# Altium project Control Board.PrjPcb
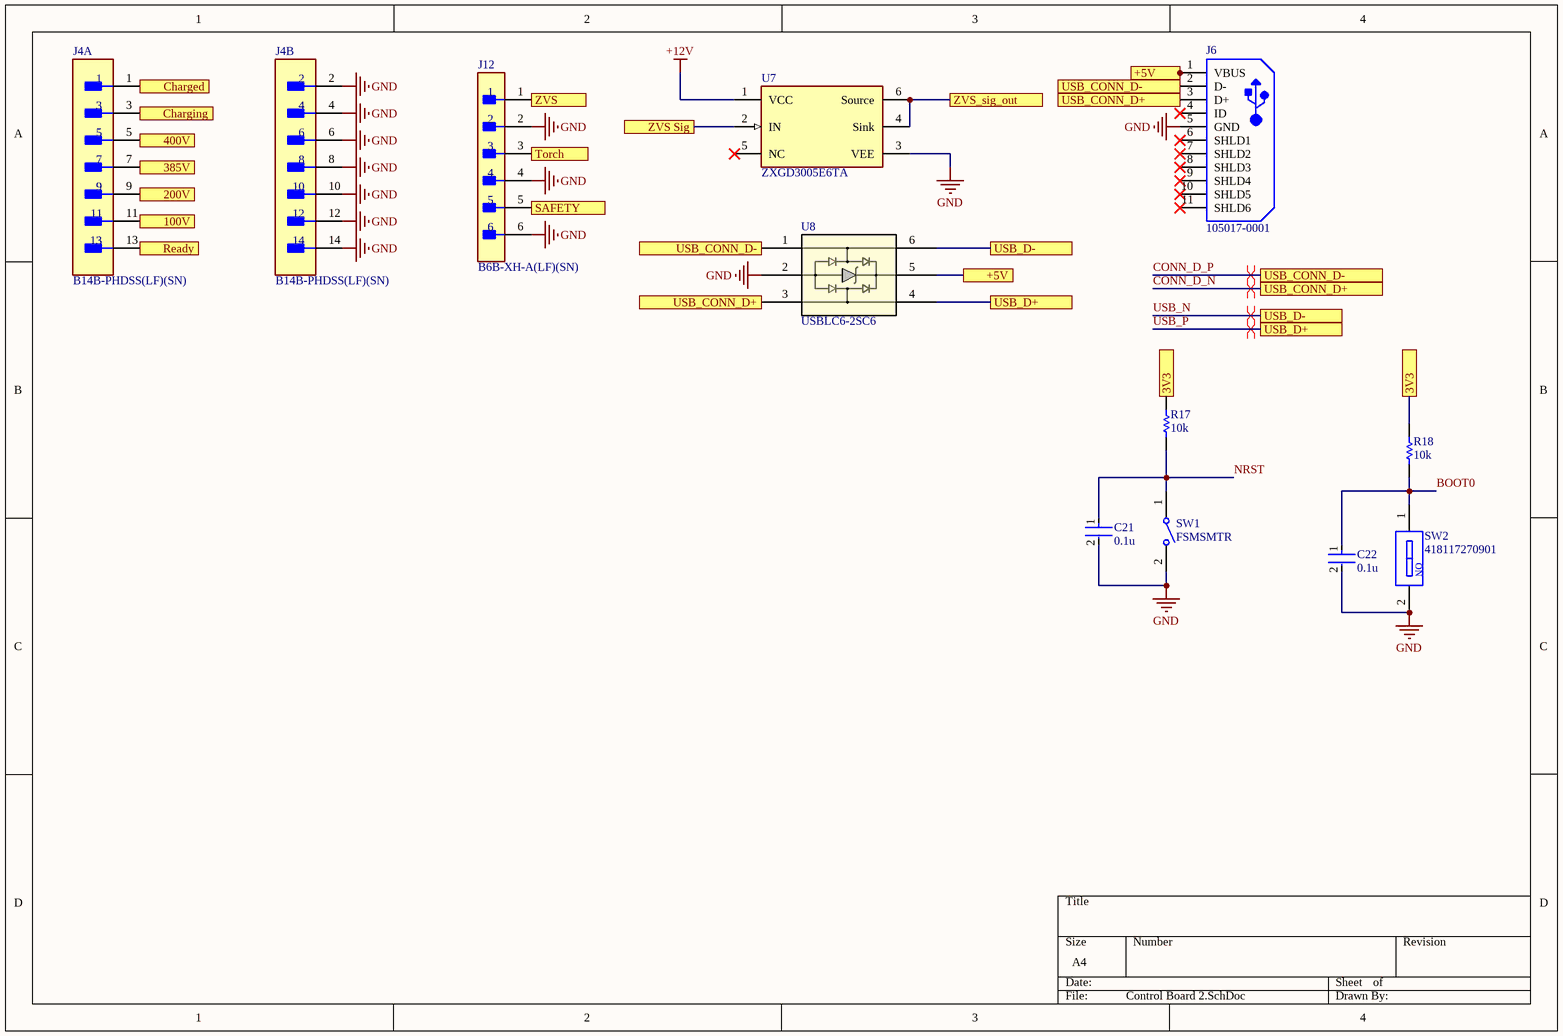
[diagram p0: Control Board 2.SchDoc]
2 sheets, 75 parts. Net scope: global (net labels, ports and power ports of the same name join across sheets).
Board file: Control board.PcbDoc
Sheets:
  Control Board 2.SchDoc
  Control board.SchDoc

## Sheet Control Board 2.SchDoc
size A4; SheetNumber: 1; SheetTotal: 2

### Parts
C21  0.1u  [FP-GRM188-0_1-e0_2_0_55-IPC_A]
C22  0.1u  [FP-GRM188-0_1-e0_2_0_55-IPC_A]
J4  B14B-PHDSS(LF)(SN)  [FP-B14B-PHDSS_LF_SN-MFG]  (parts A,B of 2)
J6  105017-0001  [USB-MICRO-B_V]
J12  B6B-XH-A(LF)(SN)  [FP-B6B-XH-A_LF_SN-MFG]
R17  10k  [RESC1609X50X30NL8T20]
R18  10k  [RESC1609X50X30NL8T20]
SW1  FSMSMTR  [TECO-FSMSMTR_V]
SW2  418117270901  [418117270901]
U7  ZXGD3005E6TA  [FP-SOT26_SC74R-MFG]
U8  USBLC6-2SC6  [SOT23-6L_STM]

### Ports
3V3, 100V, 200V, 385V, 400V, +5V, Charged, Charging, Ready, SAFETY, Torch, USB_CONN_D+, USB_CONN_D-, USB_D+, USB_D-, ZVS, ZVS Sig, ZVS_sig_out

### Nets
+12V: U7.1(VCC)
GND: C21.2 C22.2 J4.2 J4.4 J4.6 J4.8 J4.10 J4.12 J4.14 J6.5(GND) J12.2 J12.4 J12.6 SW1.2 SW2.2 U7.3(VEE) U8.2
BOOT0: C22.1 R18.2 SW2.1
CONN_D_N: J6.3(D+) U8.3 ; port USB_CONN_D+
CONN_D_P: J6.2(D-) U8.1 ; port USB_CONN_D-
NRST: C21.1 R17.2 SW1.1
USB_N: U8.6 ; port USB_D-
USB_P: U8.4 ; port USB_D+
NetC1_1: J6.1(VBUS) U8.5 ; port +5V
NetC2_1: R17.1 R18.1 ; port 3V3
NetJ3_1: U7.4(Sink) U7.6(Source) ; port ZVS_sig_out
NetJ4_1: J4.1 ; port Charged
NetJ4_3: J4.3 ; port Charging
NetJ4_5: J4.5 ; port 400V
NetJ4_7: J4.7 ; port 385V
NetJ4_9: J4.9 ; port 200V
NetJ4_11: J4.11 ; port 100V
NetJ4_13: J4.13 ; port Ready
NetJ12_1: J12.1 ; port ZVS
NetJ12_3: J12.3 ; port Torch
NetJ12_5: J12.5 ; port SAFETY
NetU1_51: U7.2(IN) ; port ZVS Sig

Not connected (* = marked no-connect by the designer): J6 4(ID)* 6(SHLD1)* 7(SHLD2)* 8(SHLD3)* 9(SHLD4)* 10(SHLD5)* 11(SHLD6)*; U7 5(NC)*

### Layout directives
differential pair: CONN_D_N, CONN_D_P, USB_N, USB_P

### Notes on the sheet
- (in symbol CMP-1435-00001-2) ON

### Library data of the parts
C21 C22 = CMP-2006-02792-2: Chip Multilayer Ceramic Capacitors for General Purpose, 0603, 10uF, X5R, 15%, 20%, 6.3V; Packaging: Tape and Reel; Voltage Rating (DC): 6.3V; Width: 0.031inch; Termination: SMD/SMT; Dielectric: X5R; Package Quantity: 4000; Voltage Rating: 6.3V; Capacitance: 10uF; Case/Package: 0603; Min Operating Temperature: -55°C; Voltage: 6.3V; Length: 1.6mm; Thickness: 0.035inch; Lead Free: Lead Free; Depth: 0.8mm; Case Code (Imperial): 0603; Max Operating Temperature: 85°C; Material: Ceramic; Height: 0.8mm; Tolerance: 20%; Mount: Surface Mount; REACH SVHC: No SVHC; Radiation Hardening: No; Case Code (Metric): 1608
J4 = CMP-17439-000218-1: CONN HEADER VERT 14POS 2MM; Current Rating: 3A; Gender: Male; Mated Stacking Heights: 8.8mm; Voltage Rating: 250V; Number of Positions: 14; Row Spacing: 0.079inch; Number of Rows: 2; Contact Material: Copper Alloy; Series: PHD; Contact Type: Male Pin; Termination: Solder; Packaging: Bulk; Fastening Type: Detent; Length: 15.9mm; Mount: Through Hole; Insulation Material: Nylon; Contact Plating: Tin; Lead Free: Lead Free; Height: 9.5mm; Housing Material: Nylon; Width: 5mm; Color: Natural; Contact Shape: Square; Flammability Rating: UL94 V-0; Pitch: 2mm; Contact Finish - Mating: TIN; Contact Mating Length: 0.114inch; Insulation Color: Natural; Connector Type: Header; Housing Color: Natural; Number of Contacts: 14
J6 = CMP-2000-05827-1: Micro-USB B Receptacle, Right Angle, Bottom Mount, Surface Mount, with Solder Tabs, -30 to 85 degC, 5-Pin USB, RoHS, Tape and Reel; Manufacturer: Molex; Featured Product: Micro-USBConnectorsUSBConnectors; Other Names: WM1399DKR; Package Version: Rev. F, 12/2012; Number of Contacts: 5; Connector Type: USB-microB; Catalog Drawings: 1050170001; 3D Model: 105017-0001.stp; Mating Products: WM17145-ND-CABLEMICROUSBBTOSTDA1.0MWM17147-ND-CABLEMICROUSBBTOSTDA2.0MWM17146-ND-CABLEMICROUSBBTOSTDA1.5M; PCN Assembly/Origin: ResinSupplier21/Oct/2015; Voltage - Max: 30V; Online Catalog: Molex-MicroUSB; Manufacturer URL: http://www.molex.com/; Package Description: 5-Leads USB, Micro B, Body 7.5 x 5 mm, Pitch 0.65 mm; Datasheet URL: http://www.molex.com/elqNow/elqRedir.htm?ref=http://www.molex.com/webdocs/datasheets/pdf/en-us/1050170001_IO_CONNECTORS.pdf; Ingress Protection: -; Datasheet Version: 03/2016; Mounting Type: BoardCutout,SurfaceMount,RightAngle; Circuits: 5; Standard Package: 1; Package Reference: MICRO-B; Package URL: http://www.molex.com/pdm_docs/sd/1050170001_sd.pdf; Category: Connectors,Interconnects; Series: -; RoHS Information: 1050170001CertofCompliance; Features: Shielded,SolderRetention; Family: USB,DVI,HDMIConnectors; Specifications: -; Gender: Receptacle; Packaging: Digi-Reel®; Mounting Technology: SurfaceMount
J12 = CMP-17439-000076-1: CONN HEADER VERT 6POS 2.5MM
R17 R18 = CMP-1666-00005-4: Chip Resistor, 10 KOhm, +/- 1%, 100 mW, -55 to 155 degC, 0603 (1608 Metric), RoHS, Tape and Reel; Manufacturer: Vishay Semiconductor; Voltage Rating: 75 V; Max Operating Temperature: 155 degC; PackageDescription: 2-Pin Surface Mount Device, Body 1.575 x 0.85 mm; ComponentLink1Description: Manufacturer URL; RoHSCompliant: true; PackageReference: 0603; REACH SVHC: Unknown; Length: 1.55 mm; DatasheetVersion: 06/2012; Packaging: Tape and Reel; Min Operating Temperature: -55 degC; Mounting Technology: Surface Mount; ComponentLink2URL: https://datasheet.ciiva.com/11809/0900766b80d98afc-11809037.pdf; Height: 0.45 mm; ComponentLink2Description: Datasheet; Package Quantity: 5000; ComponentLink1URL: http://www.vishay.com/
SW1 = CMP-2000-07501-1: FSMSM Push Button Switch, 50 mA, -35 to 85 degC, 2-Pin SMD, RoHS, Tape and Reel; Manufacturer: TE Connectivity; Voltage Rating (DC): 24V; Electrical Life: 20000Cycles; Operating Force: 180gf; Switch Travel: 0.25mm; Contact Current Rating: 50mA; Case\/Package: SMD/SMT; Actuator Length: 1.07mm; Throw Configuration: SPST; Actuator Material: Polyamide; Contact Resistance: 100mOhm; Illumination Type: Illuminated; Max Voltage Rating (DC): 12V; Manufacturer URL: http://www.te.com/; Lead Free: LeadFree; Packaging: TapeandReel; Min Operating Temperature: -35degC; Mechanical Life: 20000Cycles; Mount: SurfaceMount; REACH SVHC: Unknown; Package Quantity: 1800; Package Reference: FSMSMTR; RoHSCompliant: true; Max Operating Temperature: 85degC; Orientation: Straight; ELV: Compliant; Datasheet URL: http://www.te.com/commerce/DocumentDelivery/DDEController?Action=showdoc&DocId=Customer+Drawing%7F1437566-3%7FC2%7Fpdf%7FEnglish%7FENG_CD_1437566-3_C2_1437566_3_1_c.dwg.pdf%7F1437566-4; Package Description: 2-Pin Surface Mount Device, Body 6 x 3.5 mm, Pitch 9.19 mm; Current Rating: 50mA; Contact Plating: Silver; Termination: GullWing; Datasheet Version: Rev. C2, 08/2014; Contact Material: Brass; Mounting Technology: SurfaceMount
SW2 = CMP-1435-00001-2: NexarPartId: 22584988; Mechanical Life: 5kcycles; Number of Positions: 1; Life (Cycles): 2kcycles; Insulation Resistance: 100MΩ; Contact Resistance: 50mΩ; Voltage Rating: 24V; Current Rating: 25mA; Body Material: Nylon, Polyamide; Washable: No; Throw Configuration: SPST; Pitch: 2.54mm; Lead Free: Lead Free; Mount: Through Hole; Max Operating Temperature: 85°C; RoHS: Compliant; Number of Pins: 1; Height: 6.95mm; Min Operating Temperature: -40°C; Termination: PC Pin; Number of Circuits: 1; Contact Current Rating: 25mA; Contact Plating: Gold; Electrical Life: 2kcycles; Voltage Rating (DC): 24V; Length: 3.84mm
U7 = CMP-12751-000002-1: IC GATE DRVR LOW-SIDE SOT26; Manufacturer: DIODES INC.; Max Supply Voltage: 25V; Number Of Outputs: 1; Max Power Dissipation: 1.1W; Fall Time: 16ns; Automotive Grade: Grade 0; Output Current: 10A; Rise Time: 8ns; Max Junction Temp: +150°C; Nominal Supply Current: 0.05uA; Standoff Height: 0.013mm; RoHS: TRUE; Temperature Range Low: -55°C; Octopart: https://octopart.com/zxgd3005e6ta-diodes+inc.-19727179; Lead Free: Yes; Device Class L3: Gate Drivers; ComponentLink2URL: https://www.diodes.com/assets/Datasheets/ZXGD3005E6.pdf; Digikey Description: IC GATE DRVR LOW-SIDE SOT26; ComponentLink2Description: Datasheet; Category: IC; Footprint Url: https://www.diodes.com/assets/Package-Files/SOT26-SC74R.pdf; Device Class L1: Integrated Circuits (ICs); Automotive: Yes; Device Class L2: Power Management ICs; Mouser Description: Gate Drivers 10A GATE DRIVER 25V VCC 25V VIN; Manufacturer Part Number: ZXGD3005E6TA; Ipc Land Pattern Name: SOT95P280X115-6; Height: 1.4mm; Temperature Range High: +150°C; Package: SOT26 (SC74R); Number Of Drivers: 1; Temperature: -55°C to +150°C
U8 = USBLC6-2SC6: No Description Available; Mfr_Name: STMicroelectronics; Copyright: Copyright (C) 2023 Ultra Librarian. All rights reserved.; Manufacturer_Part_Number: USBLC6-2SC6; RefDes: RefDes; Type: DEV

## Sheet Control board.SchDoc
size A4; SheetNumber: 2; SheetTotal: 2
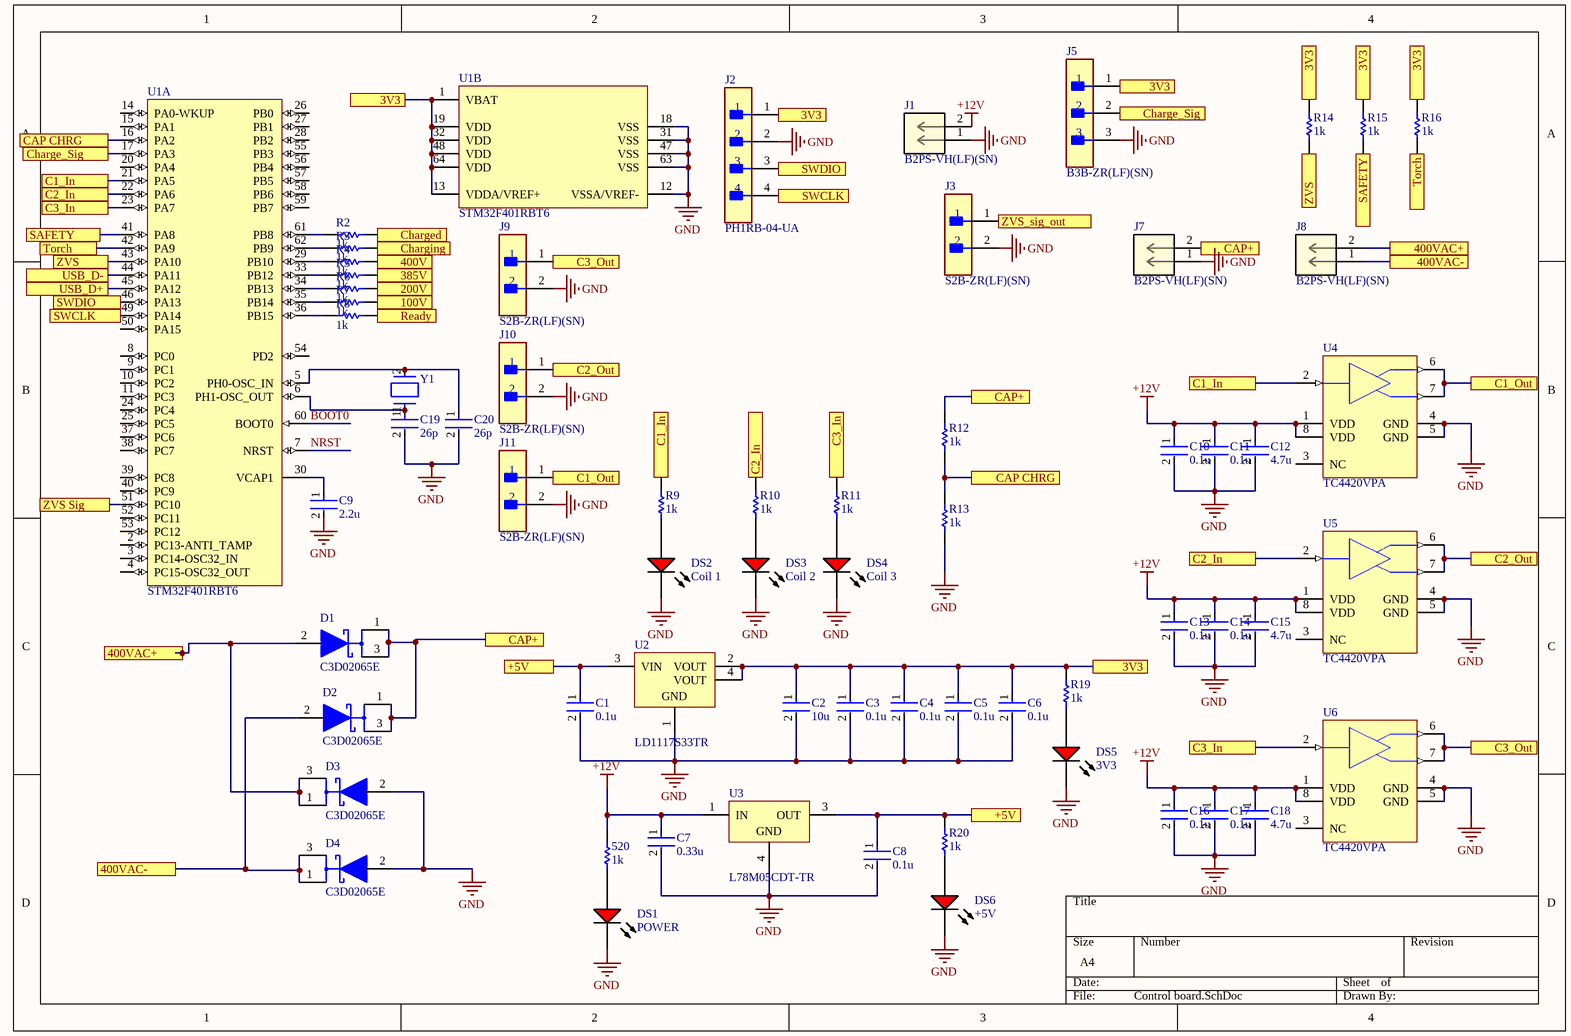
[diagram p1: Control board.SchDoc]

### Parts
520  1k  [RESC1609X50X30NL8T20]
C1  0.1u  [FP-GRM188-0_1-e0_2_0_55-IPC_A]
C2  10u  [FP-GRM188-0_1-e0_2_0_55-IPC_A]
C3  0.1u  [FP-GRM188-0_1-e0_2_0_55-IPC_A]
C4  0.1u  [FP-GRM188-0_1-e0_2_0_55-IPC_A]
C5  0.1u  [FP-GRM188-0_1-e0_2_0_55-IPC_A]
C6  0.1u  [FP-GRM188-0_1-e0_2_0_55-IPC_A]
C7  0.33u  [FP-GRM188-0_1-e0_2_0_55-IPC_A]
C8  0.1u  [FP-GRM188-0_1-e0_2_0_55-IPC_A]
C9  2.2u  [FP-GRM188-0_1-e0_2_0_55-IPC_A]
C10  0.1u  [FP-C0603C-CF-MFG]
C11  0.1u  [FP-C0603C-CF-MFG]
C12  4.7u  [FP-C0603C-CF-MFG]
C13  0.1u  [FP-C0603C-CF-MFG]
C14  0.1u  [FP-C0603C-CF-MFG]
C15  4.7u  [FP-C0603C-CF-MFG]
C16  0.1u  [FP-C0603C-CF-MFG]
C17  0.1u  [FP-C0603C-CF-MFG]
C18  4.7u  [FP-C0603C-CF-MFG]
C19  26p  [FP-GRM188-0_1-e0_2_0_55-IPC_A]
C20  26p  [FP-GRM188-0_1-e0_2_0_55-IPC_A]
D1  C3D02065E  [FP-TO-252-2_v2-MFG]
D2  C3D02065E  [FP-TO-252-2_v2-MFG]
D3  C3D02065E  [FP-TO-252-2_v2-MFG]
D4  C3D02065E  [FP-TO-252-2_v2-MFG]
DS1  POWER  [VISH-TLMX1100_V]
DS2  Coil 1  [VISH-TLMX1100_V]
DS3  Coil 2  [VISH-TLMX1100_V]
DS4  Coil 3  [VISH-TLMX1100_V]
DS5  3V3  [VISH-TLMX1100_V]
DS6  +5V  [VISH-TLMX1100_V]
J1  B2PS-VH(LF)(SN)  [CONN_B2PS-VH_JST]
J2  PH1RB-04-UA  [FP-PH1RB-04-UA-MFG]
J3  S2B-ZR(LF)(SN)  [FP-S2B-ZR_LF_SN-MFG]
J5  B3B-ZR(LF)(SN)  [FP-B3B-ZR_LF_SN-MFG]
J7  B2PS-VH(LF)(SN)  [CONN_B2PS-VH_JST]
J8  B2PS-VH(LF)(SN)  [CONN_B2PS-VH_JST]
J9  S2B-ZR(LF)(SN)  [FP-S2B-ZR_LF_SN-MFG]
J10  S2B-ZR(LF)(SN)  [FP-S2B-ZR_LF_SN-MFG]
J11  S2B-ZR(LF)(SN)  [FP-S2B-ZR_LF_SN-MFG]
R2  1k  [RESC1609X50X30NL8T20]
R3  1k  [RESC1609X50X30NL8T20]
R4  1k  [RESC1609X50X30NL8T20]
R5  1k  [RESC1609X50X30NL8T20]
R6  1k  [RESC1609X50X30NL8T20]
R7  1k  [RESC1609X50X30NL8T20]
R8  1k  [RESC1609X50X30NL8T20]
R9  1k  [RESC1609X50X30NL8T20]
R10  1k  [RESC1609X50X30NL8T20]
R11  1k  [RESC1609X50X30NL8T20]
R12  1k  [RESC1609X50X30NL8T20]
R13  1k  [RESC1609X50X30NL8T20]
R14  1k  [RESC1609X50X30NL8T20]
R15  1k  [RESC1609X50X30NL8T20]
R16  1k  [RESC1609X50X30NL8T20]
R19  1k  [RESC1609X50X30NL8T20]
R20  1k  [RESC1609X50X30NL8T20]
U1  STM32F401RBT6  [STM-LQFP64_N]  (parts A,B of 2)
U2  LD1117S33TR  [SOT-223_L]
U3  L78M05CDT-TR  [TO-252_L]
U4  TC4420VPA  [PDIP300-PA8]
U5  TC4420VPA  [PDIP300-PA8]
U6  TC4420VPA  [PDIP300-PA8]
Y1  (no value)  [FP-ABM7-MFG]

### Ports
3V3, 100V, 200V, 385V, 400V, 400VAC+, 400VAC-, +5V, C1_In, C1_Out, C2_In, C2_Out, C3_In, C3_Out, CAP CHRG, CAP+, Charge_Sig, Charged, Charging, Ready, SAFETY, SWCLK, SWDIO, Torch, USB_D+, USB_D-, ZVS, ZVS Sig, ZVS_sig_out

### Nets
+12V: 520.2 C7.1 C10.1 C11.1 C12.1 C13.1 C14.1 C15.1 C16.1 C17.1 C18.1 J1.2 U3.1(IN) U4.1(VDD) U4.8(VDD) U5.1(VDD) U5.8(VDD) U6.1(VDD) U6.8(VDD)
GND: C1.2 C2.2 C3.2 C4.2 C5.2 C6.2 C7.2 C8.2 C9.2 C10.2 C11.2 C12.2 C13.2 C14.2 C15.2 C16.2 C17.2 C18.2 C19.2 C20.2 D3.2(A) D4.2(A) DS1.2(K) DS2.2(K) DS3.2(K) DS4.2(K) DS5.2(K) DS6.2(K) J1.1 J2.2 J3.2 J5.3 J7.1 J9.2 J10.2 J11.2 R13.1 U1.12(VSSA/VREF-) U1.18(VSS) U1.31(VSS) U1.47(VSS) U1.63(VSS) U2.1(GND) U3.4(GND) U4.4(GND) U4.5(GND) U5.4(GND) U5.5(GND) U6.4(GND) U6.5(GND)
BOOT0: U1.60(BOOT0)
NRST: U1.7(NRST)
USB_N: U1.44(PA11) ; port USB_D-
USB_P: U1.45(PA12) ; port USB_D+
Net520_1: 520.1 DS1.1(A)
NetC1_1: C1.1 C8.1 R20.2 U2.3(VIN) U3.3(OUT) ; port +5V
NetC2_1: C2.1 C3.1 C4.1 C5.1 C6.1 J2.1 J5.1 R14.2 R15.2 R16.2 R19.2 U1.1(VBAT) U1.13(VDDA/VREF+) U1.19(VDD) U1.32(VDD) U1.48(VDD) U1.64(VDD) U2.2(VOUT) U2.4(VOUT) ; port 3V3
NetC9_1: C9.1 U1.30(VCAP1)
NetC19_1: C19.1 U1.6(PH1-OSC_OUT) Y1.1
NetC20_1: C20.1 U1.5(PH0-OSC_IN) Y1.2
NetD1_1: D1.1(C) D1.3(C) D2.1(C) D2.3(C) J7.2 R12.2 ; port CAP+
NetD1_2: D1.2(A) D3.1(C) D3.3(C) J8.2 ; port 400VAC+
NetD2_2: D2.2(A) D4.1(C) D4.3(C) J8.1 ; port 400VAC-
NetDS2_1: DS2.1(A) R9.1
NetDS3_1: DS3.1(A) R10.1
NetDS4_1: DS4.1(A) R11.1
NetDS5_1: DS5.1(A) R19.1
NetDS6_1: DS6.1(A) R20.1
NetJ2_3: J2.3 U1.46(PA13) ; port SWDIO
NetJ2_4: J2.4 U1.49(PA14) ; port SWCLK
NetJ3_1: J3.1 ; port ZVS_sig_out
NetJ4_1: R2.1 ; port Charged
NetJ4_3: R3.1 ; port Charging
NetJ4_5: R4.1 ; port 400V
NetJ4_7: R5.1 ; port 385V
NetJ4_9: R6.1 ; port 200V
NetJ4_11: R7.1 ; port 100V
NetJ4_13: R8.1 ; port Ready
NetJ5_2: J5.2 U1.17(PA3) ; port Charge_Sig
NetJ9_1: J9.1 U6.6(OUT) U6.7(OUT) ; port C3_Out
NetJ10_1: J10.1 U5.6(OUT) U5.7(OUT) ; port C2_Out
NetJ11_1: J11.1 U4.6(OUT) U4.7(OUT) ; port C1_Out
NetJ12_1: R14.1 U1.43(PA10) ; port ZVS
NetJ12_3: R16.1 U1.42(PA9) ; port Torch
NetJ12_5: R15.1 U1.41(PA8) ; port SAFETY
NetR2_2: R2.2 U1.61(PB8)
NetR3_2: R3.2 U1.62(PB9)
NetR4_2: R4.2 U1.29(PB10)
NetR5_2: R5.2 U1.33(PB12)
NetR6_2: R6.2 U1.34(PB13)
NetR7_2: R7.2 U1.35(PB14)
NetR8_2: R8.2 U1.36(PB15)
NetR9_2: R9.2 U1.21(PA5) U4.2(IN) ; port C1_In
NetR10_2: R10.2 U1.22(PA6) U5.2(IN) ; port C2_In
NetR11_2: R11.2 U1.23(PA7) U6.2(IN) ; port C3_In
NetR12_1: R12.1 R13.2 U1.16(PA2) ; port CAP CHRG
NetU1_51: U1.51(PC10) ; port ZVS Sig

Not connected (* = marked no-connect by the designer): U1 2(PC13-ANTI_TAMP) 3(PC14-OSC32_IN) 4(PC15-OSC32_OUT) 8(PC0) 9(PC1) 10(PC2) 11(PC3) 14(PA0-WKUP) 15(PA1) 20(PA4) 24(PC4) 25(PC5) 26(PB0) 27(PB1) 28(PB2) 37(PC6) 38(PC7) 39(PC8) 40(PC9) 50(PA15) 52(PC11) 53(PC12) 54(PD2) 55(PB3) 56(PB4) 57(PB5) 58(PB6) 59(PB7); U4 3(NC); U5 3(NC); U6 3(NC)

### Library data of the parts
520 R2-R16 R19 R20 = CMP-1666-00005-4: as R17 on sheet Control Board 2; Max Operating Temperature: 155 degC; PackageDescription: 2-Pin Surface Mount Device, Body 1.575 x 0.85 mm; ComponentLink1Description: Manufacturer URL; RoHSCompliant: true; PackageReference: 0603; REACH SVHC: Unknown; Length: 1.55 mm; DatasheetVersion: 06/2012; Packaging: Tape and Reel; Min Operating Temperature: -55 degC; Mounting Technology: Surface Mount; ComponentLink2URL: https://datasheet.ciiva.com/11809/0900766b80d98afc-11809037.pdf; Height: 0.45 mm; ComponentLink2Description: Datasheet; Package Quantity: 5000; ComponentLink1URL: http://www.vishay.com/
C1-C9 C19 C20 = CMP-2006-02792-2: as C21 on sheet Control Board 2; Packaging: Tape and Reel; Voltage Rating (DC): 6.3V; Width: 0.031inch; Termination: SMD/SMT; Dielectric: X5R; Package Quantity: 4000; Voltage Rating: 6.3V; Capacitance: 10uF; Case/Package: 0603; Min Operating Temperature: -55°C; Voltage: 6.3V; Length: 1.6mm; Thickness: 0.035inch; Lead Free: Lead Free; Depth: 0.8mm; Case Code (Imperial): 0603; Max Operating Temperature: 85°C; Material: Ceramic; Height: 0.8mm; Tolerance: 20%; Mount: Surface Mount; REACH SVHC: No SVHC; Radiation Hardening: No; Case Code (Metric): 1608
C10-C18 = CMP-2006-03061-2: CAP CER 0.1UF 50V X7R 0603; Manufacturer: KEMET; Manufacturer Part Number: C0603C104K5RACTU; Tolerance: 0.1; Temperature Coefficient: 30ppm/°C; Material: Ceramic; Automotive Grade: Grade 1; Value: 0.10 μF; Temperature: -55°C to +125°C; RoHS: TRUE; Temperature Range High: +125°C; Lead Free: Yes; Octopart: https://octopart.com/c0603c104k5ractu-kemet-139244; Digikey Description: CAP CER 0.1UF 50V X7R 0603; Category: Cap; Package: C0603C-CF; ComponentLink2Description: Datasheet; Temperature Range Low: -55°C; Device Class L1: Passive Components; Voltage Rating: 50 V; Automotive: Yes; Device Class L3: Ceramic Capacitors; ComponentLink2URL: https://api.kemet.com/component-edge/download/datasheet/C0603C100J5GACAUTO.pdf; Capacitance: 0.10 μF; Device Class L2: Capacitors; Temperature Characteristic: X7R; Height: 0.87mm
D1-D4 = CMP-240925-000076-3: DIODE SCHOTTKY 650V 2A TO252-2; Reverse Recovery Time: 0ns; Average Rectified Current: 8A; Max Reverse Voltage (DC): 650V; Number of Pins: 3; Mount: Surface Mount; Packaging: Rail/Tube; Series: Z-Rec®; Case/Package: TO-252-3; RoHS Compliant: Yes
DS1-DS6 = CMP-1666-00027-1: LED, RED, 2.1 V, -40 to 100 degC, 2-Pin SMD (0603), RoHS, Tape and Reel; Type (Capacitors): C0G; Resistance: 100000000000 Ohm; Capacitance: 12 pF; Voltage Rating: 50 V; Tolerance: 5%; Min Operating Temperature: -55degC; REACH SVHC: No SVHC; ComponentLink2Description: Datasheet; ComponentLink1URL: http://www.vishay.com/; Width: 0.8 mm; Package Quantity: 4000; PackageReference: TLMX1100; ComponentLink2URL: http://www.vishay.com/docs/83173/tlmb1100.pdf; Case/Package: 0603; Case Code (Metric): 1608; Packaging: Tape and Reel; Pins: 2; ComponentLink1Description: Manufacturer URL; Max Operating Temperature: 125degC; Height: 0.8 mm; Length: 1.6 mm; Mount: Surface Mount; PackageDescription: 2-Pin Surface Mount Device, Body 1.6 x 0.8 mm; DatasheetVersion: Rev. 2.7, 03/2016; Case Code (Imperial): 0603; Voltage Rating (DC): 50 V; RoHSCompliant: True; Radiation Hardening: No
J1 J7 J8 = B2PS-VHLFSN: No Description Available; Mfr_Name: JST; Copyright: Copyright (C) 2023 Ultra Librarian. All rights reserved.; Manufacturer_Part_Number: B2PS-VH(LF)(SN); RefDes: RefDes; Type: DEV
J2 = CMP-02275-12075420-1: PH1RB-04-UA Conn Unshrouded Header HDR 4 POS 2.54mm Solder RA Thru-Hole; NexarPartId: 12075420; RoHS: Non-Compliant
J3 J9-J11 = CMP-2000-07021-2: CONN HEADER R/A 2POS 1.5MM; Body Plating: Tin; Max Voltage Rating (AC): 50V; Contact Resistance: 30mR; Insulation Resistance: 500MR; Current Rating: 1A; Number of Contacts: 2; Gender: Male; Panel Thickness: 3.5mm; Number of Pins: 2; Packaging: Bulk; Insulation Material: Nylon; Min Operating Temperature: -25°C; Max Operating Temperature: 85°C; Contact Mating Length: 0.094inch; Insulation Color: Natural; Termination: Solder; Contact Plating: Tin; Lead Free: Lead Free; Width: 3.5mm; Connector Type: Header; Lead Pitch: 1.5mm; Orientation: Right Angle; Contact Shape: Circular; Voltage Rating: 50V; Pitch: 1.5mm; Voltage Rating (DC): 50V; Number of Rows: 1; Series: ZH; Material: Nylon; Length: 4.5mm; Contact Finish - Mating: TIN; Mount: Through Hole; Contact Material: Brass; Voltage Rating (AC): 50V; Max Current Rating: 1A; Fastening Type: Detent; Number of Positions: 2; Depth: 6mm; Housing Material: Polyamide; Contact Type: Male Pin; Height: 7.2mm; Color: White; Housing Color: Beige; REACH SVHC: No SVHC; Flammability Rating: UL94 V-0
J5 = CMP-17439-000041-1: CONN HEADER VERT 3POS 1.5MM; Gender: Male; Max Voltage Rating (AC): 50V; Body Plating: Tin; Panel Thickness: 3.5mm; Number of Contacts: 3; Connector Type: Male Pin; Max Current Rating: 1A; Insulation Resistance: 500MR; Contact Resistance: 30mR; Pitch: 1.5mm; Lead Pitch: 1.5mm; Termination: Solder; Material: Nylon; Depth: 3.5mm; Min Operating Temperature: -25°C; Voltage Rating (DC): 50V; Number of Positions: 3; Voltage Rating (AC): 50V; Contact Plating: Tin; Housing Material: Polyamide; Mount: Through Hole; Number of Rows: 1; Series: ZH; Lead Free: Lead Free; Flammability Rating: UL94 V-0; Housing Color: Beige; REACH SVHC: No SVHC; Current Rating: 1A; Contact Type: Male Pin; Orientation: Straight; Voltage Rating: 50V; Packaging: Bulk; Color: Natural; Length: 6mm; Contact Material: Copper; Max Operating Temperature: 85°C; Fastening Type: Detent; Contact Mating Length: 0.094inch
U1 = CMP-0243-00094-2: ARM Cortex-M4 32-bit MCU+FPU, 105 DMIPS, 128 kB Flash, 64 kB Internal RAM, 48 I/Os, 64-pin LQFP, -40 to 85 degC, Tray; Manufacturer: STMicroelectronics; Internal RAM Size (kB): 64; FLASH Size (Prog) (kB): 128; Supply Voltage(Vcc) max (V): 3.6; I/Os (High Current): 48; Supply Voltage(Vcc) min (V): 1.8; Operating Frequency(F) (Processor speed) (MHz): 84; Core: ARM Cortex-M4; PackageDescription: 64-Pin Low Profile Quad Flat Package, 10 x 10 mm Body, 0.5 mm Pitch; Mounting Technology: Surface Mount; PackageVersion: Rev. 4, 06/2013; ComponentLink1URL: http://www.st.com/web/en/home.html; ComponentLink3Description: Package Specification; ComponentLink2Description: Datasheet; ComponentLink3URL: http://www.st.com/st-web-ui/static/active/en/resource/technical/document/datasheet/DM00037051.pdf; ComponentLink2URL: http://www.st.com/st-web-ui/static/active/en/resource/technical/document/data_brief/DM00071938.pdf; DatasheetVersion: Rev. 1; Packing: Tray; PackageReference: LQFP64; PartNumber: STM32F401RBT6; ComponentLink1Description: Manufacturer URL
U2 = CMP-0244-00310-1: Fixed Low Drop Positive Voltage Regulator, 3.3V, 4-Pin SOT-223, Tape and Reel; ComponentLink2Description: Datasheet; PackageDescription: 4-Pin SOT-223 Package, 6.5 x 3.5 mm Body, 2.3 mm Pitch, 7 mm Lead Span; PackageVersion: 2010; ComponentLink2URL: http://www.st.com/internet/com/TECHNICAL_RESOURCES/TECHNICAL_LITERATURE/DATASHEET/CD00000544.pdf; PackageReference: SOT-223; DatasheetVersion: 1/11/2011; ComponentLink1Description: Manufacturer URL; ComponentLink1URL: http://www.st.com
U3 = CMP-0244-00178-1: Positive Voltage Regulator, 5V, 3-Pin DPAK, Tape and Reel; PackageReference: TO-252; ComponentLink1URL: http://www.st.com; ComponentLink2Description: Datasheet; PackageDescription: 3-Pin Transistor Outline Package 2.28 mm Pitch, 9.7 mm Lead Span (DPAK); ComponentLink1Description: Manufacturer URL; DatasheetVersion: 1/11/2010; ComponentLink2URL: http://www.st.com/internet/com/TECHNICAL_RESOURCES/TECHNICAL_LITERATURE/DATASHEET/CD00000447.pdf; PackageVersion: 2011
U4-U6 = CMP-0137-00023-1: 6A High-Speed MOSFET Driver, Non-Inverting, Extended Temperature; PackageDescription: 8-Lead Plastic Dual In-Line (PA) - 300 mil Body [PDIP]; PackageVersion: revBB, Aug-2009; PackageReference: PDIP300-PA8; DatasheetVersion: revC, Aug-2004; Code_JEDEC: MS-001-BA
Y1 = CMP-27762-000095-1: Crystal 16MHz ±20ppm 18pF SMD-2 6mm x 3.5mm; ESR (Equivalent Series Resistance): 50R; Frequency Stability: 30ppm; Width: 3.3mm; Frequency: 16MHz; Radiation Hardening: No; Height: 0.055inch; Tolerance: 20ppm; Length: 6mm; Case/Package: CSMD; Lead Free: Lead Free; Min Operating Temperature: -40°C; Termination: SMD/SMT; Operating Frequency: 16 MHz; Resistor Type: Ceramic; Packaging: Tape and Reel; Mount: Surface Mount; Load Capacitance: 18pF; Frequency Tolerance: 20ppm; Depth: 3.5mm; Series: ABM7; Package Quantity: 1000; Max Operating Temperature: 85°C; Number of Pins: 2

## Nets that join several sheets
+12V: Control Board 2 (U7.1), Control board (19 pins)
GND: Control Board 2 (17 pins), Control board (50 pins)
BOOT0: Control Board 2 (C22.1 R18.2 SW2.1), Control board (U1.60)
NetC1_1: Control Board 2 (J6.1 U8.5), Control board (5 pins)
NetC2_1: Control Board 2 (R17.1 R18.1), Control board (19 pins)
NetJ3_1: Control Board 2 (U7.4 U7.6), Control board (J3.1)
NetJ4_1: Control Board 2 (J4.1), Control board (R2.1)
NetJ4_3: Control Board 2 (J4.3), Control board (R3.1)
NetJ4_5: Control Board 2 (J4.5), Control board (R4.1)
NetJ4_7: Control Board 2 (J4.7), Control board (R5.1)
NetJ4_9: Control Board 2 (J4.9), Control board (R6.1)
NetJ4_11: Control Board 2 (J4.11), Control board (R7.1)
NetJ4_13: Control Board 2 (J4.13), Control board (R8.1)
NetJ12_1: Control Board 2 (J12.1), Control board (R14.1 U1.43)
NetJ12_3: Control Board 2 (J12.3), Control board (R16.1 U1.42)
NetJ12_5: Control Board 2 (J12.5), Control board (R15.1 U1.41)
NetU1_51: Control Board 2 (U7.2), Control board (U1.51)
NRST: Control Board 2 (C21.1 R17.2 SW1.1), Control board (U1.7)
USB_N: Control Board 2 (U8.6), Control board (U1.44)
USB_P: Control Board 2 (U8.4), Control board (U1.45)